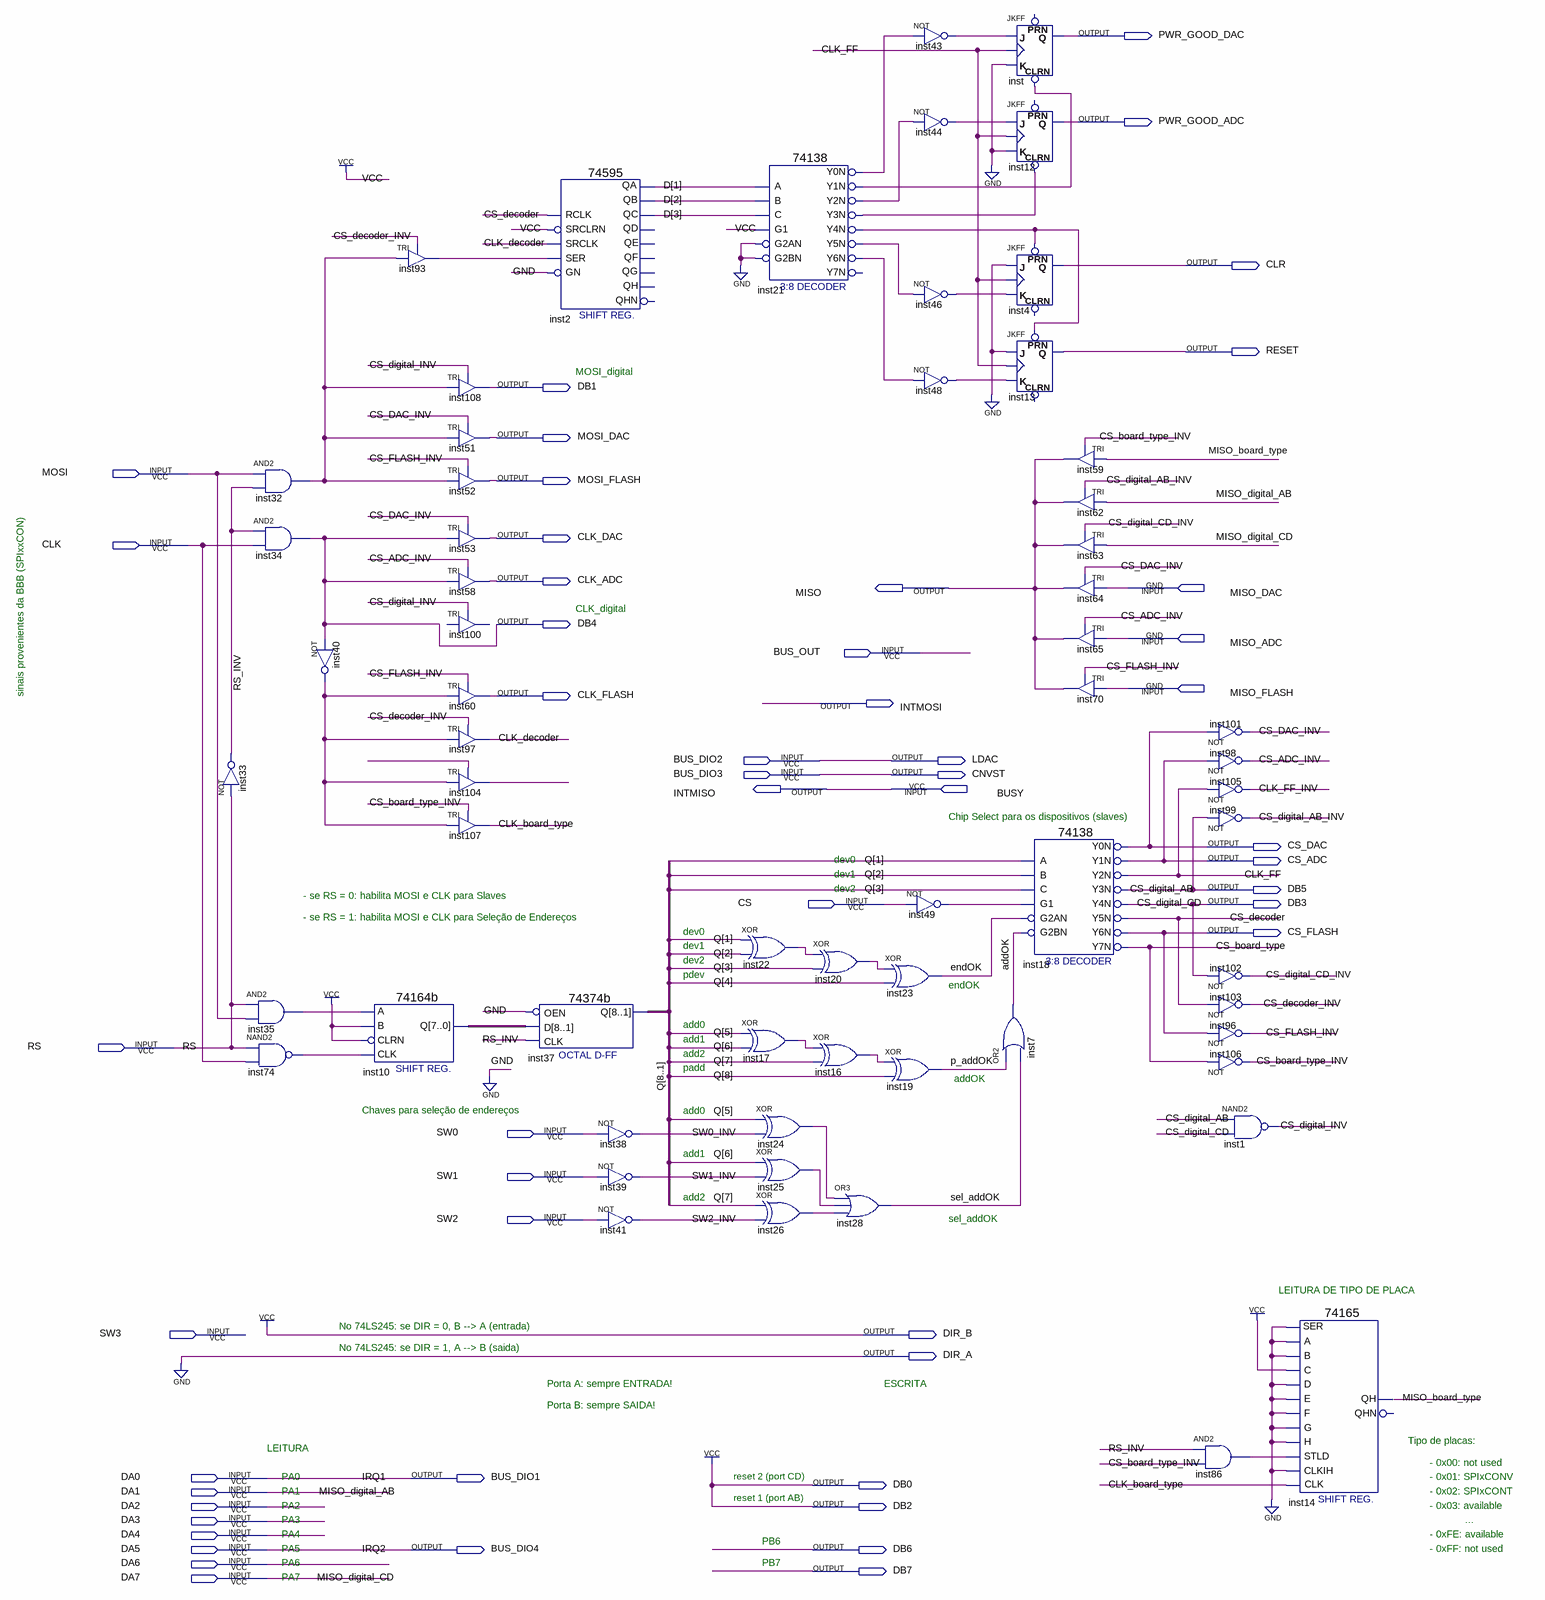
[diagram p0: schematic sheet]
// Quartus schematic SPIxCONV_v1_2_CPLD.bdf as structural Verilog: 62 symbols, 52 pins
module SPIxCONV_v1_2_CPLD (
  input  MOSI,
  input  CLK,
  input  MISO_DAC,
  input  MISO_ADC,
  input  BUS_OUT,
  input  MISO_FLASH,
  input  BUS_DIO2,
  input  BUS_DIO3,
  input  BUSY,
  input  CS,
  input  RS,
  input  SW0,
  input  SW1,
  input  SW2,
  input  SW3,
  input  DA0,
  input  DA1,
  input  DA2,
  input  DA3,
  input  DA4,
  input  DA5,
  input  DA6,
  input  DA7,
  output PWR_GOOD_DAC,
  output PWR_GOOD_ADC,
  output CLR,
  output RESET,
  output DB1,
  output MOSI_DAC,
  output MOSI_FLASH,
  output CLK_DAC,
  output CLK_ADC,
  output MISO,
  output DB4,
  output CLK_FLASH,
  output INTMOSI,
  output LDAC,
  output CNVST,
  output INTMISO,
  output CS_DAC,
  output CS_ADC,
  output DB5,
  output DB3,
  output CS_FLASH,
  output DIR_B,
  output DIR_A,
  output BUS_DIO1,
  output DB0,
  output DB2,
  output BUS_DIO4,
  output DB6,
  output DB7
);

  wire addOK, CLK_board_type, CLK_decoder, CLK_FF, CLK_FF_INV, CS_ADC_INV, CS_board_type, CS_board_type_INV,
       CS_DAC_INV, CS_decoder, CS_decoder_INV, CS_digital_AB_INV, CS_digital_CD_INV, CS_digital_INV,
       CS_FLASH_INV, endOK, inst16_out, inst17_out, inst20_out, inst21_y0n, inst21_y1n, inst21_y2n,
       inst21_y3n, inst21_y4n, inst21_y5n, inst21_y6n, inst22_out, inst24_out, inst25_out, inst26_out,
       inst32_out, inst35_out, inst40_out, inst43_out, inst44_out, inst46_out, inst48_out, inst49_out,
       inst74_out, inst86_out, inst93_out, inst104_out, MISO_board_type, p_addOK, RS_INV, sel_addOK, SW0_INV,
       SW1_INV, SW2_INV, undriven;
  wire [3:1] D;
  wire [7:0] inst10_q;
  wire [8:1] Q;

  not inst33 (RS_INV, RS);
  and inst32 (inst32_out, MOSI, RS_INV);
  and inst34 (DB4, RS_INV, CLK);
  and inst35 (inst35_out, RS, MOSI);
  nand inst74 (inst74_out, RS, CLK);
  not inst40 (inst40_out, DB4);
  TRI inst93 (.IN(inst32_out), .OE(CS_decoder_INV), .OUT(inst93_out));
  \74164b  inst10 (.A(inst35_out), .B(1'b1), .CLRN(1'b1), .CLK(inst74_out), .Q(inst10_q));
  TRI inst108 (.IN(inst32_out), .OE(CS_digital_INV), .OUT(DB1));
  TRI inst51 (.IN(inst32_out), .OE(CS_DAC_INV), .OUT(MOSI_DAC));
  TRI inst52 (.IN(inst32_out), .OE(CS_FLASH_INV), .OUT(MOSI_FLASH));
  TRI inst53 (.IN(DB4), .OE(CS_DAC_INV), .OUT(CLK_DAC));
  TRI inst58 (.IN(DB4), .OE(CS_ADC_INV), .OUT(CLK_ADC));
  TRI inst100 (.OE(CS_digital_INV));  // open: IN, OUT
  TRI inst60 (.IN(inst40_out), .OE(CS_FLASH_INV), .OUT(CLK_FLASH));
  TRI inst97 (.IN(inst40_out), .OE(CS_decoder_INV), .OUT(CLK_decoder));
  TRI inst104 (.IN(inst40_out), .OE(undriven), .OUT(inst104_out));
  TRI inst107 (.IN(inst40_out), .OE(CS_board_type_INV), .OUT(CLK_board_type));
  \74595  inst2 (
    .RCLK(CS_decoder), .SRCLRN(1'b1), .SRCLK(CLK_decoder), .SER(inst93_out), .GN(1'b0), .QC(D[3]), .QA(D[1]),
    .QB(D[2]));  // open: QHN, QH, QG, QF, QE, QD
  \74374b  inst37 (.D(inst10_q), .OEN(1'b0), .CLK(RS_INV), .Q(Q));
  not inst38 (SW0_INV, SW0);
  not inst39 (SW1_INV, SW1);
  not inst41 (SW2_INV, SW2);
  xor inst22 (inst22_out, Q[1], Q[2]);
  xor inst17 (inst17_out, Q[5], Q[6]);
  \74138  inst21 (
    .A(D[1]), .B(D[2]), .G1(1'b1), .C(D[3]), .G2AN(1'b0), .G2BN(1'b0), .Y0N(inst21_y0n), .Y1N(inst21_y1n),
    .Y2N(inst21_y2n), .Y3N(inst21_y3n), .Y4N(inst21_y4n), .Y5N(inst21_y5n), .Y6N(inst21_y6n));  // open: Y7N
  xor inst24 (inst24_out, Q[5], SW0_INV);
  xor inst25 (inst25_out, Q[6], SW1_INV);
  xor inst26 (inst26_out, Q[7], SW2_INV);
  xor inst20 (inst20_out, inst22_out, Q[3]);
  xor inst16 (inst16_out, inst17_out, Q[7]);
  or inst28 (sel_addOK, inst24_out, inst25_out, inst26_out);
  not inst43 (inst43_out, inst21_y0n);
  not inst44 (inst44_out, inst21_y2n);
  not inst46 (inst46_out, inst21_y5n);
  not inst48 (inst48_out, inst21_y6n);
  not inst49 (inst49_out, CS);
  xor inst23 (endOK, inst20_out, Q[4]);
  xor inst19 (p_addOK, inst16_out, Q[8]);
  JKFF inst (.CLRN(inst21_y1n), .K(1'b0), .J(inst43_out), .CLK(CLK_FF), .Q(PWR_GOOD_DAC));  // open: PRN
  JKFF inst12 (.CLRN(inst21_y3n), .K(1'b0), .J(inst44_out), .CLK(CLK_FF), .Q(PWR_GOOD_ADC));  // open: PRN
  JKFF inst4 (.PRN(inst21_y4n), .K(inst46_out), .J(1'b0), .CLK(CLK_FF), .Q(CLR));  // open: CLRN
  JKFF inst13 (.PRN(inst21_y4n), .K(inst48_out), .J(1'b0), .CLK(CLK_FF), .Q(RESET));  // open: CLRN
  \74138  inst18 (
    .A(Q[1]), .B(Q[2]), .G1(inst49_out), .C(Q[3]), .G2AN(endOK), .G2BN(addOK), .Y0N(CS_DAC), .Y1N(CS_ADC),
    .Y2N(CLK_FF), .Y3N(DB5), .Y4N(DB3), .Y5N(CS_decoder), .Y6N(CS_FLASH), .Y7N(CS_board_type));
  or inst7 (addOK, p_addOK, sel_addOK);
  TRI inst59 (.IN(MISO_board_type), .OE(CS_board_type_INV), .OUT(MISO));
  TRI inst62 (.IN(DA1), .OE(CS_digital_AB_INV), .OUT(MISO));
  TRI inst63 (.IN(DA7), .OE(CS_digital_CD_INV), .OUT(MISO));
  TRI inst64 (.IN(MISO_DAC), .OE(CS_DAC_INV), .OUT(MISO));
  TRI inst65 (.IN(MISO_ADC), .OE(CS_ADC_INV), .OUT(MISO));
  TRI inst70 (.IN(MISO_FLASH), .OE(CS_FLASH_INV), .OUT(MISO));
  and inst86 (inst86_out, RS_INV, CS_board_type_INV);
  not inst101 (CS_DAC_INV, CS_DAC);
  not inst98 (CS_ADC_INV, CS_ADC);
  not inst105 (CLK_FF_INV, CLK_FF);
  not inst99 (CS_digital_AB_INV, DB5);
  not inst102 (CS_digital_CD_INV, DB3);
  not inst103 (CS_decoder_INV, CS_decoder);
  not inst96 (CS_FLASH_INV, CS_FLASH);
  not inst106 (CS_board_type_INV, CS_board_type);
  nand inst1 (CS_digital_INV, DB5, DB3);
  \74165  inst14 (
    .D(1'b0), .C(1'b1), .B(1'b0), .G(1'b0), .H(1'b0), .A(1'b0), .CLKIH(1'b0), .E(1'b0), .F(1'b0),
    .CLK(CLK_board_type), .STLD(inst86_out), .SER(1'b0), .QH(MISO_board_type));  // open: QHN

  assign BUS_DIO1 = DA0;
  assign BUS_DIO4 = DA5;
  assign CNVST = BUS_DIO3;
  assign DB0 = 1'b1;
  assign DB2 = 1'b1;
  assign DIR_A = 1'b0;
  assign DIR_B = 1'b1;
  assign INTMISO = BUSY;
  assign LDAC = BUS_DIO2;

  // Other names for the same wires on the sheet: CS_digital_AB = DB5; CS_digital_CD = DB3; IRQ1 = DA0; IRQ2 = DA5;
  //   MISO_digital_AB = DA1; MISO_digital_CD = DA7

  // Notes on the sheet:
  //   MOSI_digital
  //   sinais provenientes da BBB (SPIxxCON)
  //   CLK_digital
  //   Chip Select para os dispositivos (slaves)
  //   dev0
  //   dev1
  //   dev2
  //   - se RS = 0: habilita MOSI e CLK para Slaves
  //   - se RS = 1: habilita MOSI e CLK para Seleção de Endereços
  //   dev0
  //   dev1
  //   dev2
  //   pdev
  //   endOK
  //   add0
  //   add1
  //   add2
  //   padd
  //   addOK
  //   Chaves para seleção de endereços
  //   add0
  //   add1
  //   add2
  //   sel_addOK
  //   LEITURA DE TIPO DE PLACA
  //   No 74LS245: se DIR = 0, B --> A (entrada)
  //   No 74LS245: se DIR = 1, A --> B (saida)
  //   Porta A: sempre ENTRADA!
  //   ESCRITA
  //   Porta B: sempre SAIDA!
  //   Tipo de placas:
  //   LEITURA
  //   - 0x00: not used
  //   PA0
  //   reset 2 (port CD)
  //   - 0x01: SPIxCONV
  //   PA1
  //   - 0x02: SPIxCONT 
  //   reset 1 (port AB)
  //   PA2
  //   - 0x03: available
  //   PA3
  //   ...
  //   PA4
  //   - 0xFE: available
  //   PB6
  //   PA5
  //   - 0xFF: not used
  //   PA6
  //   PB7
  //   PA7
endmodule
